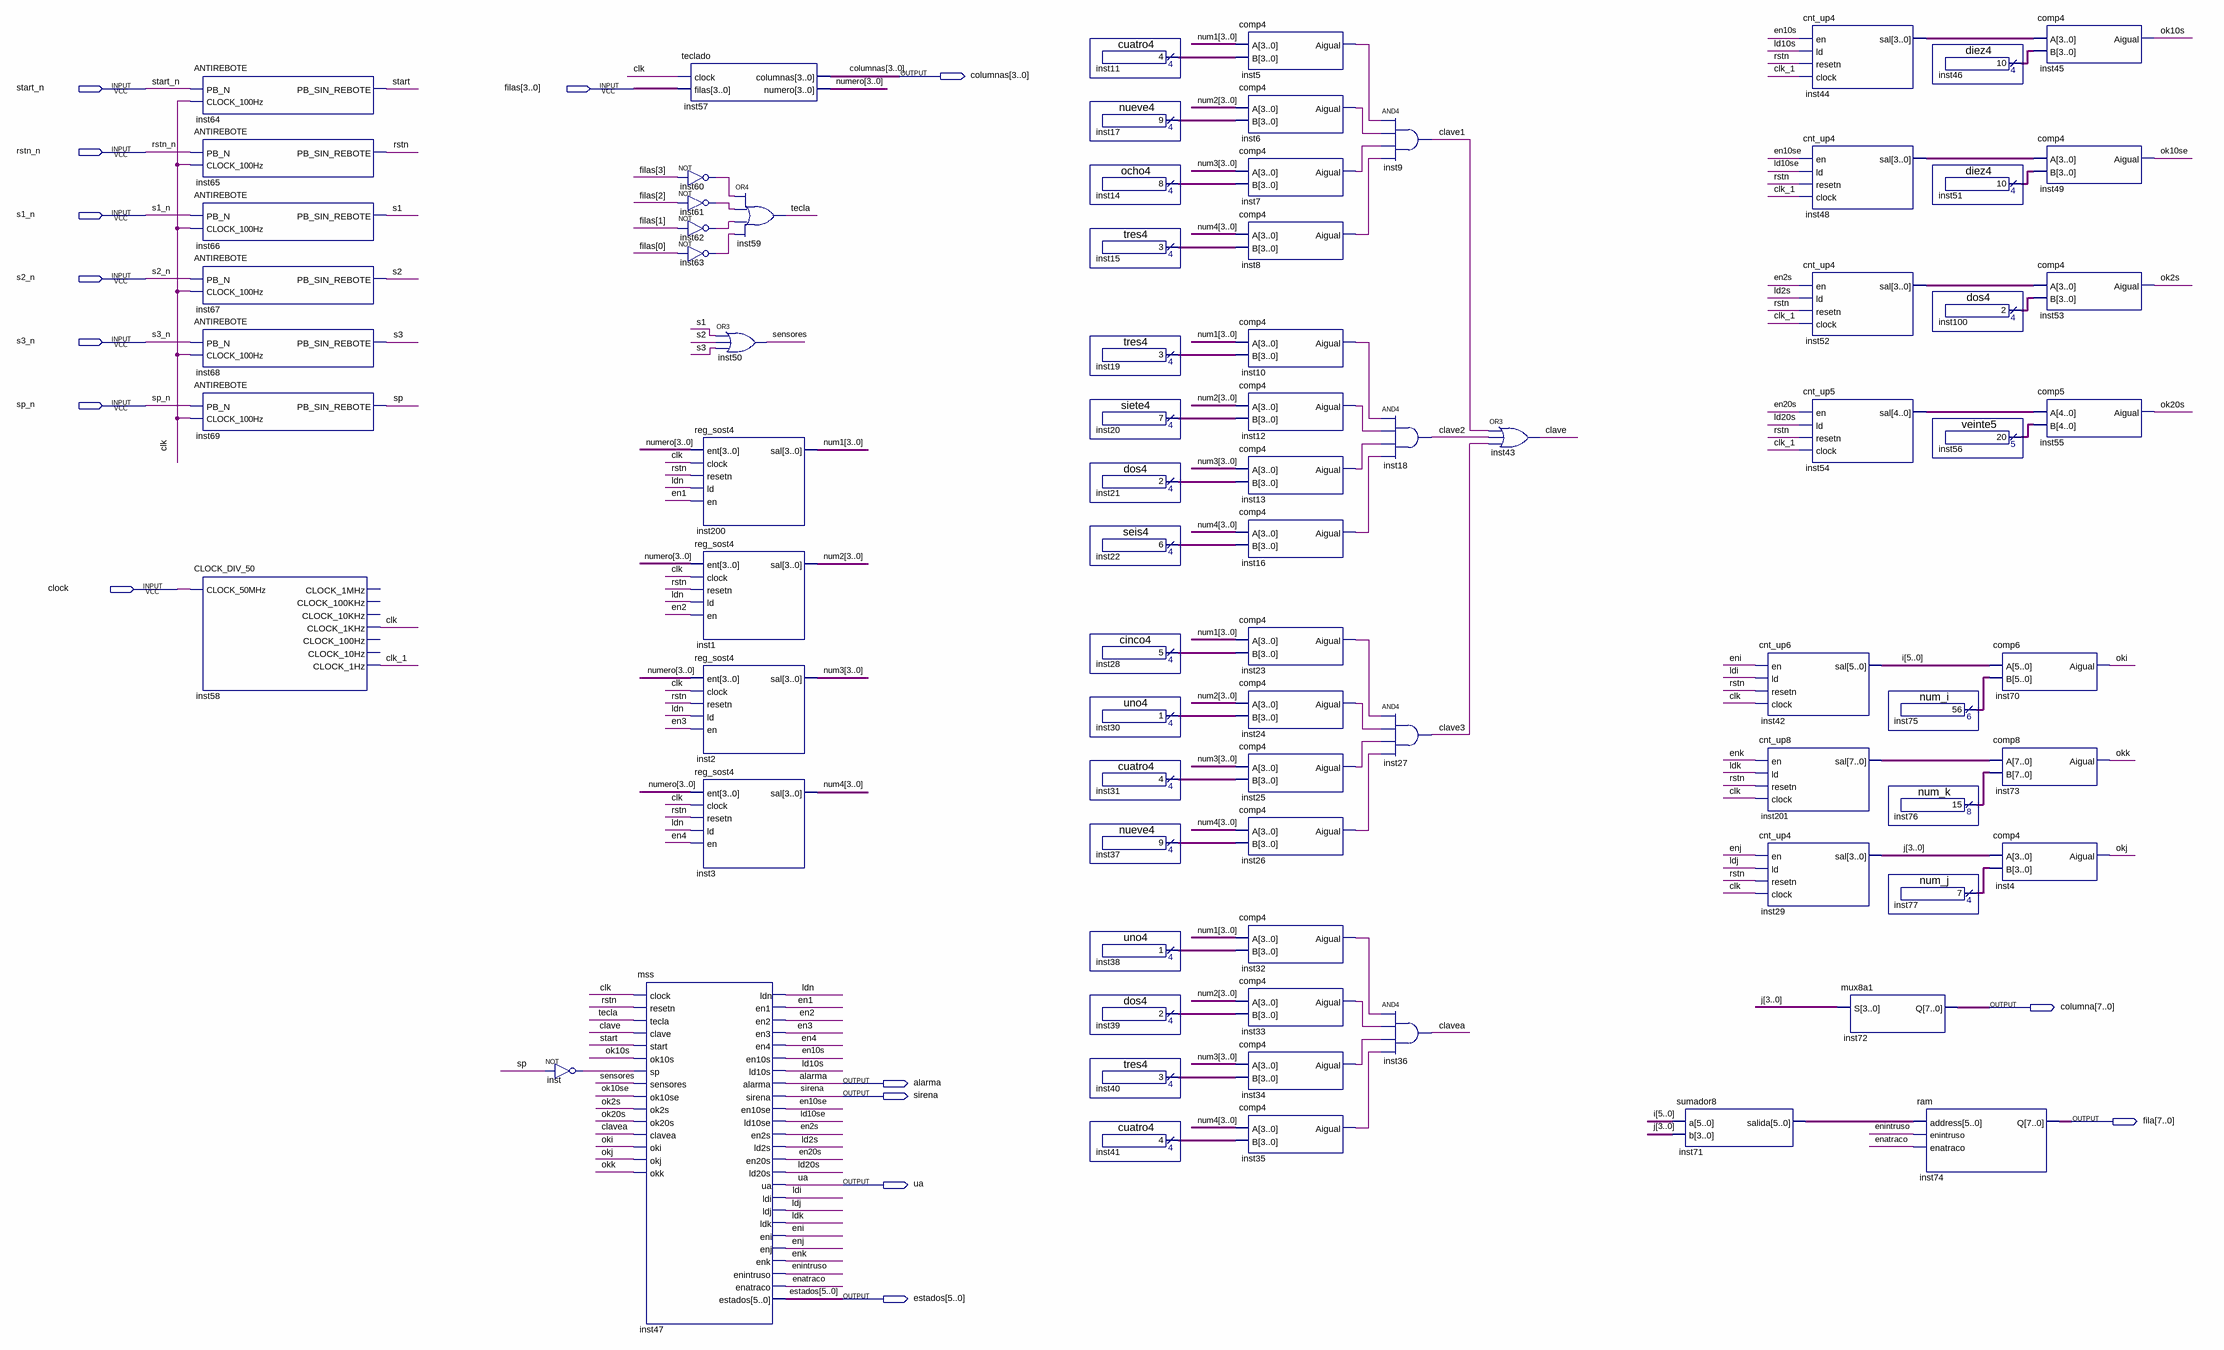
[diagram p0: schematic sheet]
// Quartus schematic particion.bdf as structural Verilog: 81 symbols, 15 pins
module particion (
  input  start_n,
  input  [3:0] filas,
  input  rstn_n,
  input  s1_n,
  input  s2_n,
  input  s3_n,
  input  sp_n,
  input  clock,
  output [3:0] columnas,
  output [7:0] columna,
  output alarma,
  output sirena,
  output [7:0] fila,
  output ua,
  output [5:0] estados
);

  wire clave, clave1, clave2, clave3, clavea, clk, clk_1, en1, en2, en2s, en3, en4, en10s, en10se, en20s,
       enatraco, eni, enintruso, enj, enk, inst5_aigual, inst6_aigual, inst7_aigual, inst8_aigual,
       inst10_aigual, inst12_aigual, inst13_aigual, inst16_aigual, inst23_aigual, inst24_aigual,
       inst25_aigual, inst26_aigual, inst32_aigual, inst33_aigual, inst34_aigual, inst35_aigual, inst60_out,
       inst61_out, inst62_out, inst63_out, inst_out, ld2s, ld10s, ld10se, ld20s, ldi, ldj, ldk, ldn, ok2s,
       ok10s, ok10se, ok20s, oki, okj, okk, rstn, s1, s2, s3, sensores, sp, start, tecla;
  wire [3:0] inst11_result, inst14_result, inst15_result, inst17_result, inst19_result, inst20_result,
       inst21_result, inst22_result, inst28_result, inst30_result, inst31_result, inst37_result,
       inst38_result, inst39_result, inst40_result, inst41_result, inst44_sal, inst46_result, inst48_sal,
       inst51_result, inst52_sal, inst77_result, inst100_result, j, num1, num2, num3, num4, numero;
  wire [4:0] inst54_sal, inst56_result;
  wire [5:0] i, inst71_salida, inst75_result;
  wire [7:0] inst76_result, inst201_sal;

  ANTIREBOTE inst64 (.PB_N(start_n), .CLOCK_100Hz(clk), .PB_SIN_REBOTE(start));
  ANTIREBOTE inst65 (.PB_N(rstn_n), .CLOCK_100Hz(clk), .PB_SIN_REBOTE(rstn));
  ANTIREBOTE inst66 (.PB_N(s1_n), .CLOCK_100Hz(clk), .PB_SIN_REBOTE(s1));
  ANTIREBOTE inst67 (.PB_N(s2_n), .CLOCK_100Hz(clk), .PB_SIN_REBOTE(s2));
  ANTIREBOTE inst68 (.PB_N(s3_n), .CLOCK_100Hz(clk), .PB_SIN_REBOTE(s3));
  ANTIREBOTE inst69 (.PB_N(sp_n), .CLOCK_100Hz(clk), .PB_SIN_REBOTE(sp));
  CLOCK_DIV_50 inst58 (
    .CLOCK_50MHz(clock), .CLOCK_1KHz(clk), .CLOCK_1Hz(clk_1));  // open: CLOCK_1MHz, CLOCK_100KHz, CLOCK_10KHz, CLOCK_100Hz, CLOCK_10Hz
  not inst (inst_out, sp);
  mss inst47 (
    .clock(clk), .resetn(rstn), .tecla(tecla), .clave(clave), .start(start), .ok10s(ok10s), .sp(inst_out),
    .sensores(sensores), .ok10se(ok10se), .ok2s(ok2s), .ok20s(ok20s), .clavea(clavea), .oki(oki), .okj(okj),
    .okk(okk), .ldn(ldn), .en1(en1), .en2(en2), .en3(en3), .en4(en4), .en10s(en10s), .ld10s(ld10s),
    .alarma(alarma), .sirena(sirena), .en10se(en10se), .ld10se(ld10se), .en2s(en2s), .ld2s(ld2s),
    .en20s(en20s), .ld20s(ld20s), .ua(ua), .ldi(ldi), .ldj(ldj), .ldk(ldk), .eni(eni), .enj(enj), .enk(enk),
    .enintruso(enintruso), .enatraco(enatraco), .estados(estados));
  teclado inst57 (.clock(clk), .filas(filas), .columnas(columnas), .numero(numero));
  not inst60 (inst60_out, filas[3]);
  not inst61 (inst61_out, filas[2]);
  not inst62 (inst62_out, filas[1]);
  not inst63 (inst63_out, filas[0]);
  reg_sost4 inst200 (.ent(numero), .clock(clk), .resetn(rstn), .ld(ldn), .en(en1), .sal(num1));
  reg_sost4 inst1 (.ent(numero), .clock(clk), .resetn(rstn), .ld(ldn), .en(en2), .sal(num2));
  reg_sost4 inst2 (.ent(numero), .clock(clk), .resetn(rstn), .ld(ldn), .en(en3), .sal(num3));
  reg_sost4 inst3 (.ent(numero), .clock(clk), .resetn(rstn), .ld(ldn), .en(en4), .sal(num4));
  or inst59 (tecla, inst60_out, inst61_out, inst62_out, inst63_out);
  or inst50 (sensores, s1, s2, s3);
  cuatro4 inst11 (.result(inst11_result));
  nueve4 inst17 (.result(inst17_result));
  ocho4 inst14 (.result(inst14_result));
  tres4 inst15 (.result(inst15_result));
  tres4 inst19 (.result(inst19_result));
  siete4 inst20 (.result(inst20_result));
  dos4 inst21 (.result(inst21_result));
  seis4 inst22 (.result(inst22_result));
  cinco4 inst28 (.result(inst28_result));
  uno4 inst30 (.result(inst30_result));
  cuatro4 inst31 (.result(inst31_result));
  nueve4 inst37 (.result(inst37_result));
  uno4 inst38 (.result(inst38_result));
  dos4 inst39 (.result(inst39_result));
  tres4 inst40 (.result(inst40_result));
  cuatro4 inst41 (.result(inst41_result));
  comp4 inst5 (.A(num1), .B(inst11_result), .Aigual(inst5_aigual));
  comp4 inst6 (.A(num2), .B(inst17_result), .Aigual(inst6_aigual));
  comp4 inst7 (.A(num3), .B(inst14_result), .Aigual(inst7_aigual));
  comp4 inst8 (.A(num4), .B(inst15_result), .Aigual(inst8_aigual));
  comp4 inst10 (.A(num1), .B(inst19_result), .Aigual(inst10_aigual));
  comp4 inst12 (.A(num2), .B(inst20_result), .Aigual(inst12_aigual));
  comp4 inst13 (.A(num3), .B(inst21_result), .Aigual(inst13_aigual));
  comp4 inst16 (.A(num4), .B(inst22_result), .Aigual(inst16_aigual));
  comp4 inst23 (.A(num1), .B(inst28_result), .Aigual(inst23_aigual));
  comp4 inst24 (.A(num2), .B(inst30_result), .Aigual(inst24_aigual));
  comp4 inst25 (.A(num3), .B(inst31_result), .Aigual(inst25_aigual));
  comp4 inst26 (.A(num4), .B(inst37_result), .Aigual(inst26_aigual));
  comp4 inst32 (.A(num1), .B(inst38_result), .Aigual(inst32_aigual));
  comp4 inst33 (.A(num2), .B(inst39_result), .Aigual(inst33_aigual));
  comp4 inst34 (.A(num3), .B(inst40_result), .Aigual(inst34_aigual));
  comp4 inst35 (.A(num4), .B(inst41_result), .Aigual(inst35_aigual));
  and inst9 (clave1, inst5_aigual, inst6_aigual, inst7_aigual, inst8_aigual);
  and inst18 (clave2, inst10_aigual, inst12_aigual, inst13_aigual, inst16_aigual);
  and inst27 (clave3, inst23_aigual, inst24_aigual, inst25_aigual, inst26_aigual);
  and inst36 (clavea, inst32_aigual, inst33_aigual, inst34_aigual, inst35_aigual);
  or inst43 (clave, clave1, clave2, clave3);
  sumador8 inst71 (.a(i), .b(j), .salida(inst71_salida));
  cnt_up6 inst42 (.en(eni), .ld(ldi), .resetn(rstn), .clock(clk), .sal(i));
  cnt_up8 inst201 (.en(enk), .ld(ldk), .resetn(rstn), .clock(clk), .sal(inst201_sal));
  cnt_up4 inst29 (.en(enj), .ld(ldj), .resetn(rstn), .clock(clk), .sal(j));
  cnt_up4 inst44 (.en(en10s), .ld(ld10s), .resetn(rstn), .clock(clk_1), .sal(inst44_sal));
  cnt_up4 inst48 (.en(en10se), .ld(ld10se), .resetn(rstn), .clock(clk_1), .sal(inst48_sal));
  cnt_up4 inst52 (.en(en2s), .ld(ld2s), .resetn(rstn), .clock(clk_1), .sal(inst52_sal));
  cnt_up5 inst54 (.en(en20s), .ld(ld20s), .resetn(rstn), .clock(clk_1), .sal(inst54_sal));
  mux8a1 inst72 (.S(j), .Q(columna));
  num_i inst75 (.result(inst75_result));
  num_k inst76 (.result(inst76_result));
  num_j inst77 (.result(inst77_result));
  ram inst74 (.address(inst71_salida), .enintruso(enintruso), .enatraco(enatraco), .Q(fila));
  diez4 inst46 (.result(inst46_result));
  diez4 inst51 (.result(inst51_result));
  dos4 inst100 (.result(inst100_result));
  veinte5 inst56 (.result(inst56_result));
  comp6 inst70 (.A(i), .B(inst75_result), .Aigual(oki));
  comp8 inst73 (.A(inst201_sal), .B(inst76_result), .Aigual(okk));
  comp4 inst4 (.A(j), .B(inst77_result), .Aigual(okj));
  comp4 inst45 (.A(inst44_sal), .B(inst46_result), .Aigual(ok10s));
  comp4 inst49 (.A(inst48_sal), .B(inst51_result), .Aigual(ok10se));
  comp4 inst53 (.A(inst52_sal), .B(inst100_result), .Aigual(ok2s));
  comp5 inst55 (.A(inst54_sal), .B(inst56_result), .Aigual(ok20s));
endmodule
